# Altium schematic sheet Controller.SchDoc: Motor Controller
size Letter; DocumentNumber: 1; SheetNumber: 1; SheetTotal: 4
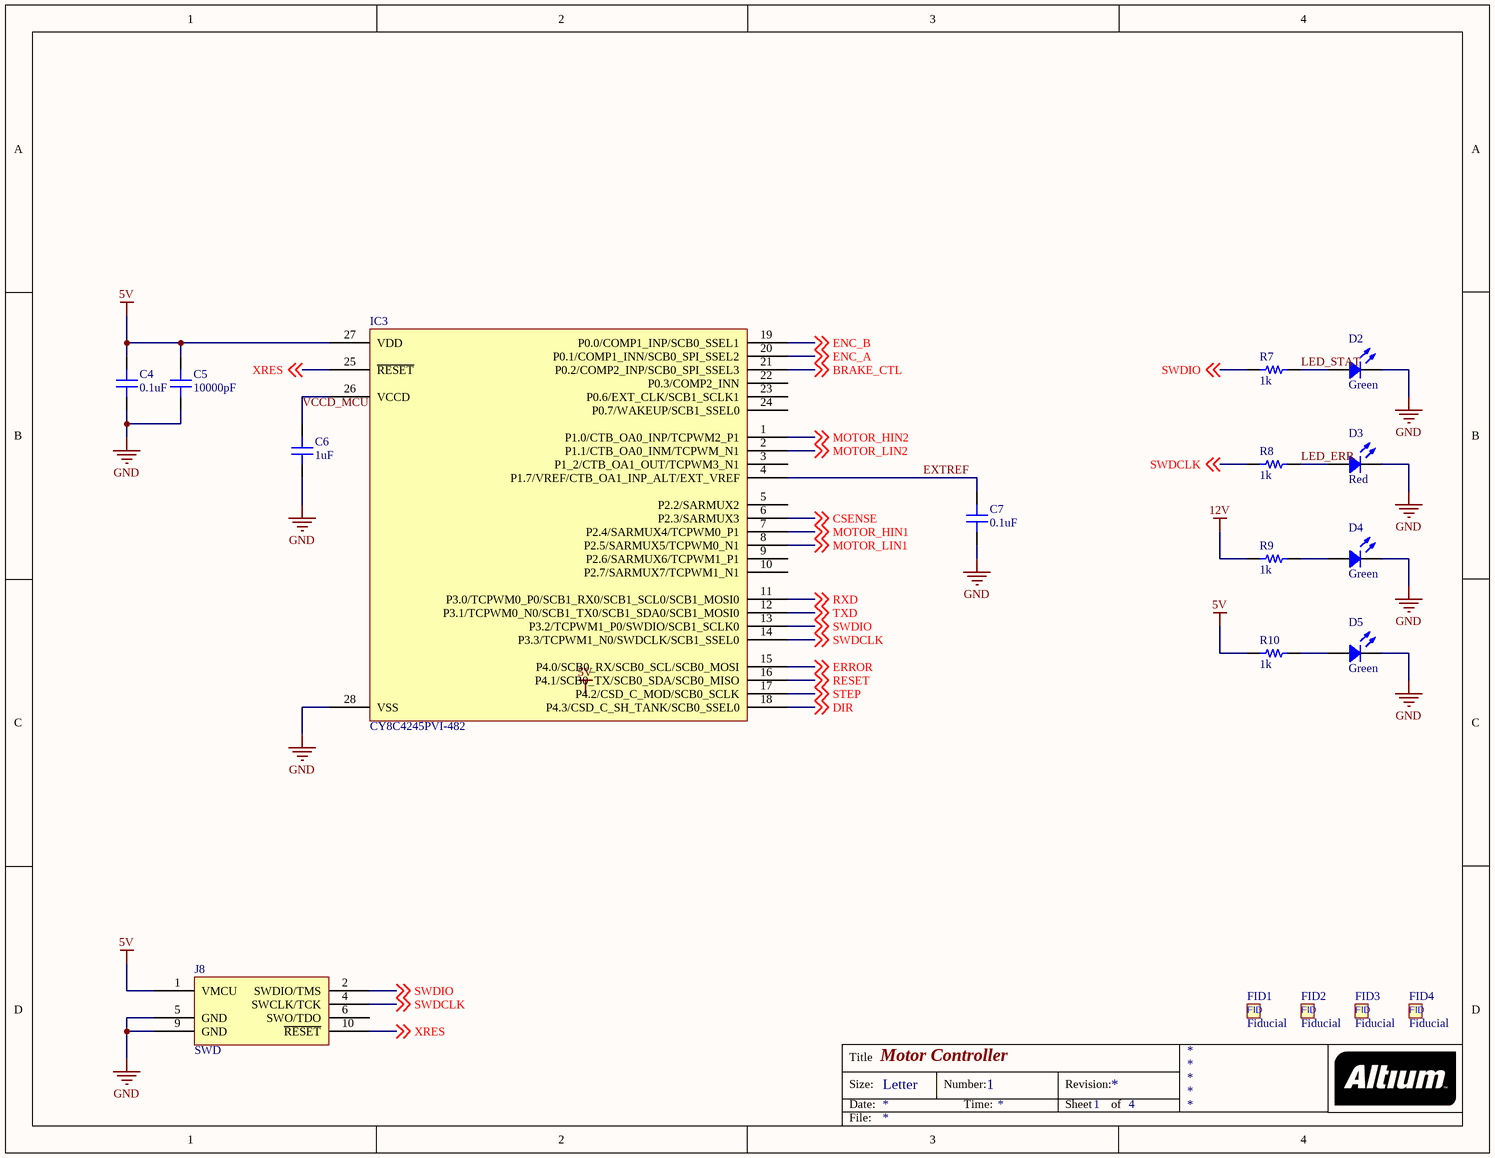
[diagram p0: Controller.SchDoc]

## Parts
C4  0.1uF  [CAP 0603/1608]
C5  10000pF  [CAP 0603/1608]
C6  1uF  [CAP 0603/1608]
C7  0.1uF  [CAP 0603/1608]
D2  Green  [LED 0603/1608 GREEN]
D3  Red  [LED 0603/1608 RED]
D4  Green  [LED 0603/1608 GREEN]
D5  Green  [LED 0603/1608 GREEN]
FID1  Fiducial  [Fiducial]  (no BOM)
FID2  Fiducial  [Fiducial]  (no BOM)
FID3  Fiducial  [Fiducial]  (no BOM)
FID4  Fiducial  [Fiducial]  (no BOM)
IC3  CY8C4245PVI-482  [CYPRESS SSOP-28 210MIL]
J8  SWD  [10 Pin SWD]  (no BOM)
R7  1k  [RES 0603/1608]
R8  1k  [RES 0603/1608]
R9  1k  [RES 0603/1608]
R10  1k  [RES 0603/1608]

## Nets
5V: C4.2 C5.2 IC3.27(VDD) J8.1(VMCU) R10.1
12V: R9.1
GND: C4.1 C5.1 C6.1 C7.1 D2.2 D3.2 D4.2 D5.2 IC3.28(VSS) J8.5(GND) J8.9(GND)
BRAKE_CTL: IC3.21(P0.2/COMP2_INP/SCB0_SPI_SSEL3) ; off-sheet BRAKE_CTL
CSENSE: IC3.6(P2.3/SARMUX3) ; off-sheet CSENSE
DIR: IC3.18(P4.3/CSD_C_SH_TANK/SCB0_SSEL0) ; off-sheet DIR
ENC_A: IC3.20(P0.1/COMP1_INN/SCB0_SPI_SSEL2) ; off-sheet ENC_A
ENC_B: IC3.19(P0.0/COMP1_INP/SCB0_SSEL1) ; off-sheet ENC_B
ERROR: IC3.15(P4.0/SCB0_RX/SCB0_SCL/SCB0_MOSI) ; off-sheet ERROR
EXTREF: C7.2 IC3.4(P1.7/VREF/CTB_OA1_INP_ALT/EXT_VREF)
LED_ERR: D3.1 R8.2
LED_STAT: D2.1 R7.2
MOTOR_HIN1: IC3.7(P2.4/SARMUX4/TCPWM0_P1) ; off-sheet MOTOR_HIN1
MOTOR_HIN2: IC3.1(P1.0/CTB_OA0_INP/TCPWM2_P1) ; off-sheet MOTOR_HIN2
MOTOR_LIN1: IC3.8(P2.5/SARMUX5/TCPWM0_N1) ; off-sheet MOTOR_LIN1
MOTOR_LIN2: IC3.2(P1.1/CTB_OA0_INM/TCPWM_N1) ; off-sheet MOTOR_LIN2
RESET: IC3.16(P4.1/SCB0_TX/SCB0_SDA/SCB0_MISO) ; off-sheet RESET
RXD: IC3.11(P3.0/TCPWM0_P0/SCB1_RX0/SCB1_SCL0/SCB1_MOSI0) ; off-sheet RXD
STEP: IC3.17(P4.2/CSD_C_MOD/SCB0_SCLK) ; off-sheet STEP
SWDCLK: IC3.14(P3.3/TCPWM1_N0/SWDCLK/SCB1_SSEL0) J8.4(SWCLK/TCK) R8.1 ; off-sheet SWDCLK
SWDIO: IC3.13(P3.2/TCPWM1_P0/SWDIO/SCB1_SCLK0) J8.2(SWDIO/TMS) R7.1 ; off-sheet SWDIO
TXD: IC3.12(P3.1/TCPWM0_N0/SCB1_TX0/SCB1_SDA0/SCB1_MOSI0) ; off-sheet TXD
VCCD_MCU: C6.2 IC3.26(VCCD)
XRES: IC3.25(~{RESET}) J8.10(~{RESET}) ; off-sheet XRES
NetD4_1: D4.1 R9.2
NetD5_1: D5.1 R10.2

Not connected (* = marked no-connect by the designer): IC3 3(P1_2/CTB_OA1_OUT/TCPWM3_N1) 5(P2.2/SARMUX2) 9(P2.6/SARMUX6/TCPWM1_P1) 10(P2.7/SARMUX7/TCPWM1_N1) 22(P0.3/COMP2_INN) 23(P0.6/EXT_CLK/SCB1_SCLK1) 24(P0.7/WAKEUP/SCB1_SSEL0); J8 6(SWO/TDO)

## Notes on the sheet
- Labels drawn without touching a wire or pin: 5V
- Title
- Size:
- Date:
- Letter
- Number:
- Time:
- Revision:
- Sheet
- of
- File:
- (in symbol Fiducial) FID

## Library data of the parts
C4 = CC0603KPX7R7BB104: CAP CER 0.1UF 16V X7R 0603; Manufacturer: Yageo; TemperatureRange: -55C ~ 125C; Tolerance: 10%; Value: 0.1uF; Part Number: CC0603KPX7R7BB104; PartId: 5262; Supplier 1: Digi-Key; Supplier Part Number 1: 311-1335-2-ND; ComponentLink1Description: Datasheet; ComponentLink1URL: http://www.yageo.com/documents/recent/UPY-GPHC_X7R_6.3V-to-50V-v12.pdf; ComponentLink2Description: Digi-Key listing; ComponentLink2URL: http://digikey.com/product-detail/en/CC0603KPX7R7BB104/311-1335-2-ND/2103073; TemperatureCoefficient: X7R; Voltage: 16V; Price: 0.0043; Type: -; Device Package: 0603 (1608 Metric)
C5 = CL10B103KB8NCNC: CAP CER 10000PF 50V X7R 0603; Manufacturer: Samsung Electro-Mechanics America, Inc.; TemperatureRange: -55C ~ 125C; Tolerance: 10%; Value: 10000pF; Part Number: CL10B103KB8NCNC; PartId: 13008; Supplier 1: Digi-Key; Supplier Part Number 1: 1276-1921-2-ND; ComponentLink1Description: Datasheet; ComponentLink1URL: http://www.samsungsem.com/kr/support/library/product-catalog/__icsFiles/afieldfile/2015/11/18/MLCC.pdf; ComponentLink2Description: Digi-Key Listing; ComponentLink2URL: https://www.digikey.com/product-detail/en/samsung-electro-mechanics-america-inc/CL10B103KB8NCNC/1276-1921-2-ND/3887579; TemperatureCoefficient: X7R; Voltage: 50V; Price: 0.0032; Device Package: 0603 (1608 Metric)
C6 = CC0603ZRY5V7BB105: CAP CER 1UF 16V Y5V 0603; Manufacturer: Yageo; TemperatureRange: -30C ~ 85C; TemperatureCoefficient: Y5V (F); Tolerance: -20%, +80%; Value: 1uF; Part Number: CC0603ZRY5V7BB105; PartId: 13115; Supplier 1: Digi-Key; Supplier Part Number 1: 311-1372-2-ND; ComponentLink1Description: Datasheet; ComponentLink1URL: http://www.yageo.com/documents/recent/UPY-GPHC_Y5V_6.3V-to-50V_6.pdf; ComponentLink2Description: Digi-Key Listing; ComponentLink2URL: https://www.digikey.com/product-detail/en/yageo/CC0603ZRY5V7BB105/311-1372-2-ND/2103110; Voltage: 16V; Price: 0.0063; Device Package: 0603 (1608 Metric)
C7 = CC0603JRX7R8BB104: CAP CER 0.1UF 25V X7R 0603; Manufacturer: Yageo; TemperatureRange: -55C ~ 125C; Tolerance: 5%; Value: 0.1uF; Part Number: CC0603JRX7R8BB104; PartId: 5305; Supplier 1: Digi-Key; Supplier Part Number 1: 311-1777-2-ND; ComponentLink1Description: Datasheet; ComponentLink1URL: http://www.yageo.com/documents/recent/UPY-GPHC_X7R_6.3V-to-50V-v12.pdf; ComponentLink2Description: Digi-Key listing; ComponentLink2URL: http://digikey.com/product-detail/en/CC0603JRX7R8BB104/311-1777-2-ND/5195186; TemperatureCoefficient: X7R; Voltage: 25V; Price: 0.0079; Type: -; Device Package: 0603 (1608 Metric)
D2 D4 D5 = LTST-C191KGKT: LED GREEN CLEAR 0603 SMD; Manufacturer: Lite-On Inc.; Type: Surface Mount; Millicandela: 35mcd; Voltage Forward: 2V; Current (Test): 20mA; Viewing Angle: 130; Value: Green; Part Number: LTST-C191KGKT; PartId: 7051; Supplier 1: Digi-Key; Supplier Part Number 1: 160-1446-2-ND; ComponentLink1Description: Datasheet; ComponentLink1URL: http://optoelectronics.liteon.com/upload/download/DS22-2000-228/S_110_LTST-C191KGKT.pdf; ComponentLink2Description: Digi-Key Listing; ComponentLink2URL: http://www.digikey.ca/product-detail/en/LTST-C191KGKT/160-1446-2-ND/386835; Price: 0.0521; Device Package: 0603 (1608 Metric); Colour: Green; Lens Transparency: Clear
D3 = LTST-C191KRKT: LED RED CLEAR 0603 SMD; Manufacturer: Lite-On Inc.; Value: Green; Millicandela: 54mcd; Voltage Forward: 2V; Current (Test): 20mA; Viewing Angle: 130; Part Number: LTST-C191KRKT; PartId: 7050; Supplier 1: Digi-Key; Supplier Part Number 1: 160-1447-2-ND; ComponentLink1Description: Datasheet; ComponentLink1URL: http://optoelectronics.liteon.com/upload/download/DS22-2000-223/S_110_LTST-C191KRKT.pdf; ComponentLink2Description: Digi-Key Listing; ComponentLink2URL: http://www.digikey.ca/product-detail/en/LTST-C191KRKT/160-1447-2-ND/386837; Price: 0.0521; Device Package: 0603 (1608 Metric); Colour: Red; Lens Transparency: Clear
IC3 = CY8C4245PVI-482: IC MCU 32BIT 32KB FLASH 28SSOP; Manufacturer: Cypress Semiconductor Corp; Core Processor: ARM Cortex-M0; Core Size: 32-Bit; Speed: 48MHz; Connectivity: IC, IrDA, LIN, Microwire, SmartCard, SPI, SSP, UART/USART; Peripherals: Brown-out Detect/Reset, CapSense, LCD, LVD, POR, PWM, WDT; Number Of IO: 22; Program Memory Size: 32KB (32K x 8); Ram Size: 4K x 8; Voltage: 1.71 V ~ 5.5 V; Data Converters: A/D 8x12b; Oscillator Type: Internal; Part Number: CY8C4245PVI-482; PartId: 21202; Supplier 1: Digi-Key; Supplier Part Number 1: CY8C4245PVI-482-ND; ComponentLink1Description: Datasheet; ComponentLink1URL: http://www.cypress.com/?docID=46322; ComponentLink2Description: Digi-Key Listing; ComponentLink2URL: https://www.digikey.com/product-detail/en/cypress-semiconductor-corp/CY8C4245PVI-482/CY8C4245PVI-482-ND/4047448; Price: 3.75; Device Package: 28-SSOP (0.209", 5.30mm Width); Series: PSOC® 4 CY8C42xx; Program Memory Type: FLASH
R7-R10 = ERJ-3GEYJ102V: RES SMD 1K OHM 5% 1/10W 0603; Manufacturer: Panasonic Electronic Components; TemperatureRange: -55C ~ 155C; TemperatureCoefficient: 200ppm/C; PowerRating: 0.1W, 1/10W; Value: 1k; Part Number: ERJ-3GEYJ102V; PartId: 11176; Supplier 1: Digi-Key; Supplier Part Number 1: P1.0KGTR-ND; ComponentLink1Description: Datasheet; ComponentLink1URL: http://industrial.panasonic.com/www-cgi/jvcr13pz.cgi?E+PZ+3+AOA0001+ERJ3GEYJ102V+7+WW; ComponentLink2Description: Digi-Key Listing; ComponentLink2URL: https://www.digikey.com/product-detail/en/panasonic-electronic-components/ERJ-3GEYJ102V/P1.0KGTR-ND/68472; Tolerance: 5%; Price: 0.002; Device Package: 0603 (1608 Metric)